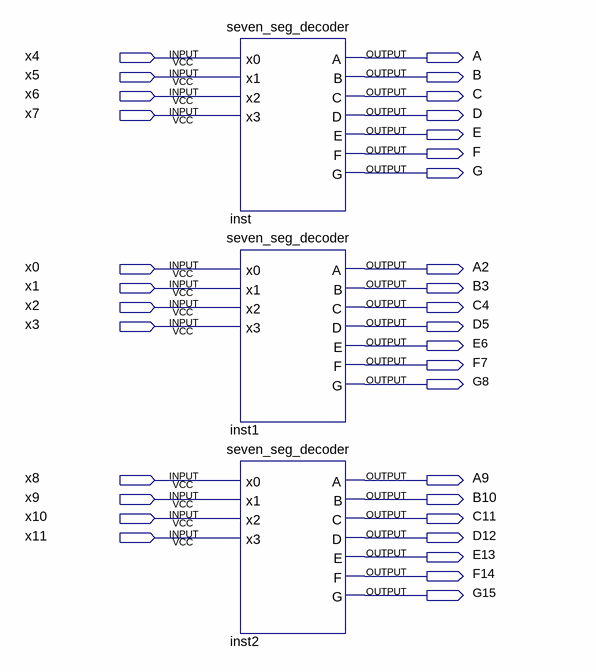
[diagram p0: schematic sheet]
// Quartus schematic test.bdf as structural Verilog: 3 symbols, 33 pins
module test (
  input  x4,
  input  x5,
  input  x6,
  input  x7,
  input  x0,
  input  x1,
  input  x2,
  input  x3,
  input  x8,
  input  x9,
  input  x10,
  input  x11,
  output A,
  output B,
  output C,
  output D,
  output E,
  output F,
  output G,
  output A2,
  output B3,
  output C4,
  output D5,
  output E6,
  output F7,
  output G8,
  output A9,
  output B10,
  output C11,
  output D12,
  output E13,
  output F14,
  output G15
);

  seven_seg_decoder inst (.x0(x4), .x1(x5), .x2(x6), .x3(x7), .A(A), .B(B), .C(C), .D(D), .E(E), .F(F), .G(G));
  seven_seg_decoder inst1 (.x0(x0), .x1(x1), .x2(x2), .x3(x3), .A(A2), .B(B3), .C(C4), .D(D5), .E(E6), .F(F7), .G(G8));
  seven_seg_decoder inst2 (
    .x0(x8), .x1(x9), .x2(x10), .x3(x11), .A(A9), .B(B10), .C(C11), .D(D12), .E(E13), .F(F14), .G(G15));
endmodule
